# Altium schematic sheet MCU.SchDoc
size A4; Organization: Altium Limited; Address1: L3, 12a Rodborough Rd; Address2: Frenchs Forest; Address3: NSW; Address4: Australia 2086
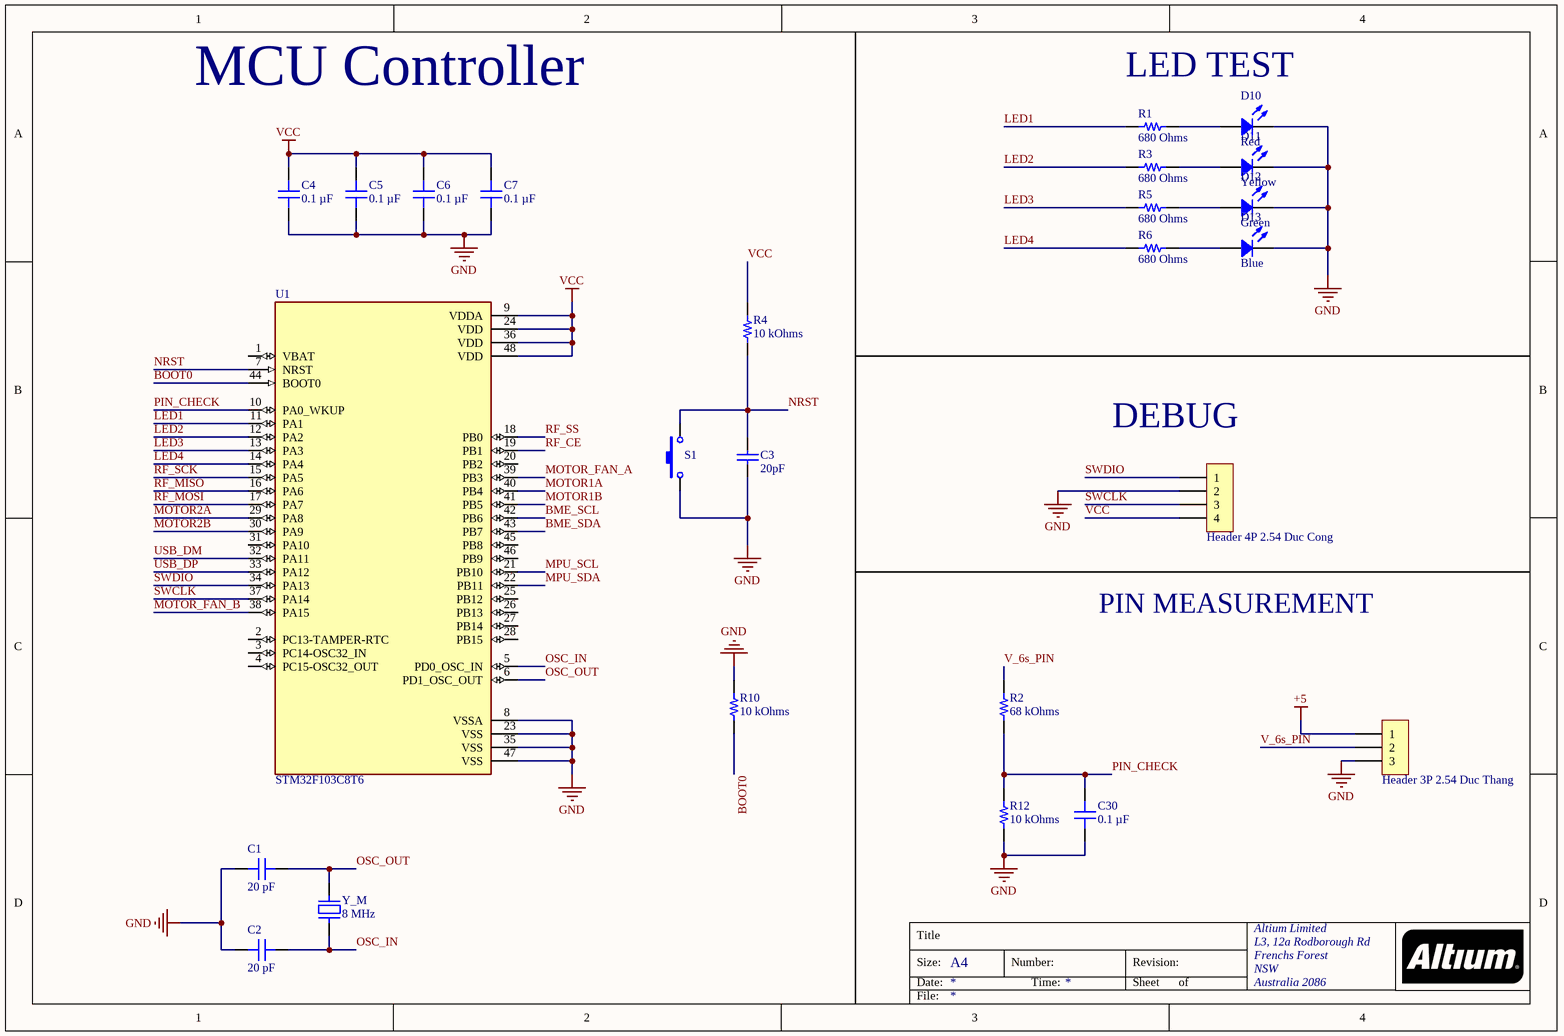
[diagram p0: MCU.SchDoc]

## Parts
C1  20 pF  [CAP 0603_1608]
C2  20 pF  [CAP 0603_1608]
C3  20pF  [tu 0805]
C4  0.1 µF  [CAP 0603_1608]
C5  0.1 µF  [CAP 0603_1608]
C6  0.1 µF  [CAP 0603_1608]
C7  0.1 µF  [CAP 0603_1608]
C30  0.1 µF  [CAP 0603_1608]
D10  Red  [LED 0603_1608 RED]
D11  Yellow  [LED 0603_1608 YELLOW]
D12  Green  [LED 0603_1608 GREEN]
D13  Blue  [LED 0603_1608 BLUE]
H5  Header 4P 2.54 Duc Cong  [Header 4P DC 2.54]
H8  Header 3P 2.54 Duc Thang  [XH2.54M-3]
R1  680 Ohms  [RES 0603_1608]
R2  68 kOhms  [RES 0805_2012]
R3  680 Ohms  [RES 0603_1608]
R4  10 kOhms  [RES 0603_1608]
R5  680 Ohms  [RES 0603_1608]
R6  680 Ohms  [RES 0603_1608]
R10  10 kOhms  [RES 0603_1608]
R12  10 kOhms  [RES 0805_2012]
S1  SW-SMD  [SW-SMD]  (value not drawn)
U1  STM32F103C8T6  [QFP50P900X900X160-48N]
Y_M  8 MHz  [NDK NX5032GA]

## Nets
+5: H8.1
GND: C1.1 C2.1 C3.2 C4.1 C5.1 C6.1 C7.1 C30.1 D10.2 D11.2 D12.2 D13.2 H5.2 H8.3 R10.1 R12.1 S1.1 U1.8(VSSA) U1.23(VSS) U1.35(VSS) U1.47(VSS)
VCC: C4.2 C5.2 C6.2 C7.2 H5.4 R4.2 U1.9(VDDA) U1.24(VDD) U1.36(VDD) U1.48(VDD)
BME_SCL: U1.42(PB6)
BME_SDA: U1.43(PB7)
BOOT0: R10.2 U1.44(BOOT0)
LED1: R1.1 U1.11(PA1)
LED2: R3.1 U1.12(PA2)
LED3: R5.1 U1.13(PA3)
LED4: R6.1 U1.14(PA4)
MOTOR1A: U1.40(PB4)
MOTOR1B: U1.41(PB5)
MOTOR2A: U1.29(PA8)
MOTOR2B: U1.30(PA9)
MOTOR_FAN_A: U1.39(PB3)
MOTOR_FAN_B: U1.38(PA15)
MPU_SCL: U1.21(PB10)
MPU_SDA: U1.22(PB11)
NRST: C3.1 R4.1 S1.2 U1.7(NRST)
OSC_IN: C2.2 U1.5(PD0_OSC_IN) Y_M.2
OSC_OUT: C1.2 U1.6(PD1_OSC_OUT) Y_M.1
PIN_CHECK: C30.2 R2.1 R12.2 U1.10(PA0_WKUP)
RF_CE: U1.19(PB1)
RF_MISO: U1.16(PA6)
RF_MOSI: U1.17(PA7)
RF_SCK: U1.15(PA5)
RF_SS: U1.18(PB0)
SWCLK: H5.3 U1.37(PA14)
SWDIO: H5.1 U1.34(PA13)
USB_DM: U1.32(PA11)
USB_DP: U1.33(PA12)
V_6s_PIN: H8.2 R2.2
NetD10_1: D10.1 R1.2
NetD11_1: D11.1 R3.2
NetD12_1: D12.1 R5.2
NetD13_1: D13.1 R6.2

Not connected (* = marked no-connect by the designer): U1 1(VBAT) 2(PC13-TAMPER-RTC) 3(PC14-OSC32_IN) 4(PC15-OSC32_OUT) 20(PB2) 25(PB12) 26(PB13) 27(PB14) 28(PB15) 31(PA10) 45(PB8) 46(PB9)

## Notes on the sheet
- MCU Controller
- LED TEST
- (near H5) DEBUG
- PIN MEASUREMENT
- Title
- Size:
- Date:
- A4
- Number:
- Time:
- Revision:
- Sheet
- of
- File:

## Library data of the parts
C1 C2 = C0603C200K8HAC7867: CAP CER 20PF 10V X8R 0603; manufacturer: KEMET; Tolerance: ±10%; Part Number: C0603C200K8HAC7867; Value: 20 pF; Applications: General Purpose; Capacitance: 20 pF; componentlink1description: Datasheet; componentlink1url: https://connect.kemet.com:7667/gateway/IntelliData-ComponentDocumentation/1.0/download/datasheet/C0603C200K8HAC7867; componentlink2description: DigiKey Link; componentlink2url: https://www.digikey.com/en/products/detail/kemet/C0603C200K8HAC7867/7946748; Device Package: 0603 (1608 Metric); Features: Low ESL, High Temperature; lastupdated: 2/9/2024 8:09:18 PM; Lifecycle Status: Active; Minimum Order: 1; Mounting Type: Surface Mount, MLCC; Operating Temperature: -55°C ~ 150°C; Package / Case: 0603 (1608 Metric); packaging: TapeAndReel; partid: 52193; Part Status: Active; price: 0.01; series: SMD Comm X8R HT150C; Size / Dimension: 0.063" L x 0.031" W (1.60mm x 0.80mm); Supplier 1: DigiKey; Supplier Part Number 1: 399-C0603C200K8HAC7867CT-ND; Temperature Coefficient: X8R; Thickness (Max): 0.034" (0.87mm); Voltage - Rated: 10V
C3 = Tu 0805 20pF 50V 10%: Dán; Don_Vi: Con; Ten_Linh_Kien: Tụ 0805 20P 10% 50V; So_Chan: 2; Ma_Hang: MH004558; Chung_Loai: Dán; Kieu_Chan: *
C4-C7 = VJ0603Y104MXQCW1BC: CAP CER 0.1UF 10V X7R 0603; manufacturer: Vishay Vitramon; Tolerance: ±20%; Part Number: VJ0603Y104MXQCW1BC; Value: 0.1 µF; Applications: General Purpose; Capacitance: 0.1 µF; componentlink1description: Datasheet; componentlink1url: https://www.vishay.com/docs/28548/vjw1bcbascomseries.pdf; componentlink2description: DigiKey Link; componentlink2url: https://www.digikey.com/en/products/detail/vishay-vitramon/VJ0603Y104MXQCW1BC/8305323; Device Package: 0603 (1608 Metric); lastupdated: 2/9/2024 8:09:54 PM; Lifecycle Status: Active; Minimum Order: 1; Mounting Type: Surface Mount, MLCC; Operating Temperature: -55°C ~ 125°C; Package / Case: 0603 (1608 Metric); packaging: TapeAndReel; partid: 34594; Part Status: Active; price: 0.01; series: VJ W1BC; Size / Dimension: 0.063" L x 0.031" W (1.60mm x 0.80mm); Supplier 1: DigiKey; Supplier Part Number 1: 720-VJ0603Y104MXQCW1BCCT-ND; Temperature Coefficient: X7R; Thickness (Max): 0.034" (0.87mm); Voltage - Rated: 10V
C30 = VJ0603Y104KXQCW1BC: CAP CER 0.1UF 10V X7R 0603; manufacturer: Vishay Vitramon; Tolerance: ±10%; Part Number: VJ0603Y104KXQCW1BC; Value: 0.1 µF; Applications: General Purpose; Capacitance: 0.1 µF; componentlink1description: Datasheet; componentlink1url: https://www.vishay.com/docs/28548/vjw1bcbascomseries.pdf; componentlink2description: DigiKey Link; componentlink2url: https://www.digikey.com/en/products/detail/vishay-vitramon/VJ0603Y104KXQCW1BC/8305317; Device Package: 0603 (1608 Metric); lastupdated: 2/9/2024 8:10:06 PM; Lifecycle Status: Active; Minimum Order: 1; Mounting Type: Surface Mount, MLCC; Operating Temperature: -55°C ~ 125°C; Package / Case: 0603 (1608 Metric); packaging: TapeAndReel; partid: 17766; Part Status: Active; price: 0.02; series: VJ W1BC; Size / Dimension: 0.063" L x 0.031" W (1.60mm x 0.80mm); Supplier 1: DigiKey; Supplier Part Number 1: 720-1689-1-ND; Temperature Coefficient: X7R; Thickness (Max): 0.034" (0.87mm); Voltage - Rated: 10V
D10 = 5975112402F: LED RED DIFFUSED 0603 SMD; Manufacturer: Dialight; Configuration: Standard; Current - Test: 20mA; Lens Color: White; Lens Size: 1.10mm x 0.80mm; Lens Style: Rectangle with Flat Top; Millicandela Rating: 11.7mcd; Viewing Angle: 152°; Voltage - Forward (Vf) (Typ): 1.7V; Wavelength - Dominant: 647nm; Wavelength - Peak: 660nm; Part Number: 5975112402F; Color: Red; ComponentLink1Description: Datasheet; ComponentLink1URL: http://www.dialightsignalsandcomponents.com/Assets/Brochures_And_Catalogs/Indication/597-xxxx-4xx.pdf; ComponentLink2Description: DigiKey Link; ComponentLink2URL: https://www.digikey.com/en/products/detail/dialight/5975112402F/2432586; Device Package: 0603 (1608 Metric); Height (Max): 0.70mm; LastUpdated: 6/3/2024 7:59:47 PM; Lens Transparency: Diffused; Lifecycle Status: Active; Minimum Order: 1; Mounting Type: Surface Mount; Package / Case: 0603 (1608 Metric); Packaging: Strip; PartId: 449; Part Status: Active; Price: 0.24; Series: 597; Size / Dimension: 1.60mm L x 0.80mm W; Supplier 1: DigiKey; Supplier Part Number 1: 350-2890-ND; Supplier Device Package: 2-SMD; Value: Red
D11 = SML-D15YWT86: LED YELLOW DIFFUSED 1608 SMD; Manufacturer: Rohm Semiconductor; Configuration: Standard; Current - Test: 20mA; Lens Color: White; Lens Size: 1.20mm x 0.80mm; Lens Style: Rectangle with Flat Top; Millicandela Rating: 224mcd; Voltage - Forward (Vf) (Typ): 2.1V; Wavelength - Dominant: 590nm; Part Number: SML-D15YWT86; Color: Yellow; ComponentLink1Description: Datasheet; ComponentLink1URL: http://rohmfs.rohm.com/en/products/databook/datasheet/opto/led/chip_mono/sml-d15-e.pdf; ComponentLink2Description: DigiKey Link; ComponentLink2URL: https://www.digikey.com/en/products/detail/rohm-semiconductor/SML-D15YWT86/5822344; Device Package: 0603 (1608 Metric); Height (Max): 0.65mm; LastUpdated: 6/3/2024 8:01:10 PM; Lens Transparency: Diffused; Lifecycle Status: Active; Minimum Order: 1; Mounting Type: Surface Mount; Package / Case: 0603 (1608 Metric); Packaging: TapeAndReel; PartId: 114; Part Status: Active; Price: 0.06; Series: SML-D15; Size / Dimension: 1.60mm L x 0.80mm W; Supplier 1: DigiKey; Supplier Part Number 1: SML-D15YWT86DKR-ND; Supplier Device Package: 1608 (0603); Value: Yellow
D12 = SML-D13M8WT86: LED GREEN DIFFUSED 1608 SMD; Manufacturer: Rohm Semiconductor; Configuration: Standard; Current - Test: 20mA; Lens Color: White; Lens Size: 1.20mm x 0.80mm; Lens Style: Rectangle with Flat Top; Millicandela Rating: 40mcd; Voltage - Forward (Vf) (Typ): 2.2V; Wavelength - Dominant: 572nm; Part Number: SML-D13M8WT86; Color: Green; ComponentLink1Description: Datasheet; ComponentLink1URL: https://www.rohm.com/datasheet/SML-D12V8W; ComponentLink2Description: DigiKey Link; ComponentLink2URL: https://www.digikey.com/en/products/detail/rohm-semiconductor/SML-D13M8WT86/4004597; Device Package: 0603 (1608 Metric); Height (Max): 0.65mm; LastUpdated: 6/3/2024 7:58:53 PM; Lens Transparency: Diffused; Lifecycle Status: Active; Minimum Order: 1; Mounting Type: Surface Mount; Package / Case: 0603 (1608 Metric); Packaging: TapeAndReel; PartId: 617; Part Status: Active; Price: 0.04; Series: EXCELED™; Size / Dimension: 1.60mm L x 0.80mm W; Supplier 1: DigiKey; Supplier Part Number 1: 846-1198-1-ND; Supplier Device Package: 1608 (0603); Value: Green
D13 = LB Q39G-L2OO-35-1: LED BLUE DIFFUSED 0603 SMD; Manufacturer: OSRAM Opto Semiconductors Inc.; Configuration: Standard; Current - Test: 5mA; Lens Color: White; Lens Size: 1.10mm x 0.80mm; Lens Style: Rectangle with Flat Top; Millicandela Rating: 29.5mcd; Viewing Angle: 155°, 135°; Voltage - Forward (Vf) (Typ): 2.85V; Wavelength - Dominant: 470nm; Wavelength - Peak: 472nm; Part Number: LB Q39G-L2OO-35-1; Color: Blue; ComponentLink1Description: Datasheet; ComponentLink1URL: //media.digikey.com/pdf/Data%20Sheets/Osram%20PDFs/LB_Q39G_v1.4_9-1-15.pdf; ComponentLink2Description: DigiKey Link; ComponentLink2URL: https://www.digikey.com/en/products/detail/osram-opto-semiconductors-inc/LB-Q39G-L2OO-35-1/2176322; Device Package: 0603 (1608 Metric); Height (Max): 0.40mm; LastUpdated: 6/3/2024 7:57:52 PM; Lens Transparency: Diffused; Lifecycle Status: Active; Minimum Order: 1; Mounting Type: Surface Mount; Package / Case: 0603 (1608 Metric); Packaging: TapeAndReel; PartId: 832; Part Status: Active; Price: 0.06; Series: CHIPLED 0603; Size / Dimension: 1.60mm L x 0.80mm W; Supplier 1: DigiKey; Supplier Part Number 1: 475-2816-1-ND; Supplier Device Package: 0603; Value: Blue
H5 = Header 4P 2.54 Duc Cong: Cắm; Ten_Linh_Kien: Header 4P XH2.54-4P Đực Cong; Don_Vi: Con; Ma_Hang: MH001310; Chung_Loai: Cắm
H8 = Header 3P 2.54 Duc Thang: Cắm; Ten_Linh_Kien: Header 3P XH2.54-3P Đực Thẳng; Don_Vi: Con; Ma_Hang: MH001292; Chung_Loai: Cắm
R1 R3 R5 R6 = CRGCQ0603F680R: RES 680 OHM 1% 1/10W 0603; Manufacturer: TE Connectivity Passive Product; Power (Watts): 0.1W, 1/10W; Temperature Coefficient: ±100ppm/°C; Part Number: CRGCQ0603F680R; Value: 680 Ohms; ComponentLink1Description: Datasheet; ComponentLink1URL: https://www.te.com/commerce/DocumentDelivery/DDEController?Action=srchrtrv&DocNm=1773204-3&DocType=DS&DocLang=English; ComponentLink2Description: DigiKey Link; ComponentLink2URL: https://www.digikey.com/en/products/detail/te-connectivity-passive-product/CRGCQ0603F680R/8576288; Composition: Thick Film; Device Package: 0603 (1608 Metric); Features: Automotive AEC-Q200, Moisture Resistant; Height - Seated (Max): 0.022" (0.55mm); LastUpdated: 2/9/2024 8:42:15 PM; Lifecycle Status: Active; Minimum Order: 1; Number of Terminations: 2; Operating Temperature: -55°C ~ 155°C; Package / Case: 0603 (1608 Metric); Packaging: TapeAndReel; PartId: 23982; Part Status: Active; Price: 0.01; Ratings: AEC-Q200; Resistance: 680 Ohms; Series: CRGCQ; Size / Dimension: 0.063" L x 0.031" W (1.60mm x 0.80mm); Supplier 1: DigiKey; Supplier Part Number 1: A129686CT-ND; Supplier Device Package: 0603; Tolerance: ±1%
R2 = RR1220P-683-D: RES SMD 68K OHM 0.5% 1/10W 0805; Manufacturer: Susumu; Power (Watts): 0.1W, 1/10W; Temperature Coefficient: ±25ppm/°C; Part Number: RR1220P-683-D; Value: 68 kOhms; ComponentLink1Description: Datasheet; ComponentLink1URL: http://www.susumu.co.jp/common/pdf/n_catalog_partition05_en.pdf; ComponentLink2Description: DigiKey Link; ComponentLink2URL: https://www.digikey.com/en/products/detail/susumu/RR1220P-683-D/432335; Composition: Thin Film; Device Package: 0805 (2012 Metric); Height - Seated (Max): 0.020" (0.50mm); LastUpdated: 2/8/2024 9:01:51 PM; Lifecycle Status: Active; Minimum Order: 1; Number of Terminations: 2; Operating Temperature: -55°C ~ 125°C; Package / Case: 0805 (2012 Metric); Packaging: TapeAndReel; PartId: 39193; Part Status: Active; Price: 0.01; Resistance: 68 kOhms; Series: RR; Size / Dimension: 0.079" L x 0.049" W (2.00mm x 1.25mm); Supplier 1: DigiKey; Supplier Part Number 1: RR12P68.0KDCT-ND; Tolerance: ±0.5%
R4 R10 = CRCW060310K0FHEAP: RES SMD 10K OHM 1% 1/10W 0603; Manufacturer: Vishay Dale; Power (Watts): 0.1W, 1/10W; Temperature Coefficient: ±50ppm/°C; Part Number: CRCW060310K0FHEAP; Value: 10 kOhms; ComponentLink1Description: Datasheet; ComponentLink1URL: http://www.vishay.com/docs/20036/dcrcwpe3.pdf; ComponentLink2Description: DigiKey Link; ComponentLink2URL: https://www.digikey.com/en/products/detail/vishay-dale/CRCW060310K0FHEAP/5070668; Composition: Thick Film; Device Package: 0603 (1608 Metric); Features: Automotive AEC-Q200; Height - Seated (Max): 0.020" (0.50mm); LastUpdated: 2/9/2024 8:41:44 PM; Lifecycle Status: Active; Minimum Order: 1; Number of Terminations: 2; Operating Temperature: -55°C ~ 155°C; Package / Case: 0603 (1608 Metric); Packaging: TapeAndReel; PartId: 56447; Part Status: Active; Price: 0.03; Ratings: AEC-Q200; Resistance: 10 kOhms; Series: CRCW-P; Size / Dimension: 0.063" L x 0.033" W (1.60mm x 0.85mm); Supplier 1: DigiKey; Supplier Part Number 1: 541-CRCW060310K0FHEAPCT-ND; Supplier Device Package: 0603; Tolerance: ±1%
R12 = RNCS0805BKE10K0: RES 10K OHM 0.1% 1/10W 0805; Manufacturer: Stackpole Electronics Inc; Power (Watts): 0.1W, 1/10W; Temperature Coefficient: ±25ppm/°C; Part Number: RNCS0805BKE10K0; Value: 10 kOhms; ComponentLink1Description: Datasheet; ComponentLink1URL: https://www.seielect.com/catalog/sei-rncs_rnch.pdf; ComponentLink2Description: DigiKey Link; ComponentLink2URL: https://www.digikey.com/en/products/detail/stackpole-electronics-inc/RNCS0805BKE10K0/1800067; Composition: Thin Film; Device Package: 0805 (2012 Metric); Features: Anti-Corrosive, Automotive AEC-Q200, Moisture Resistant; Height - Seated (Max): 0.026" (0.65mm); LastUpdated: 2/8/2024 9:02:39 PM; Lifecycle Status: Active; Minimum Order: 1; Number of Terminations: 2; Operating Temperature: -55°C ~ 155°C; Package / Case: 0805 (2012 Metric); Packaging: TapeAndReel; PartId: 27713; Part Status: Active; Price: 0.07; Ratings: AEC-Q200; Resistance: 10 kOhms; Series: RNCS; Size / Dimension: 0.079" L x 0.049" W (2.00mm x 1.25mm); Supplier 1: DigiKey; Supplier Part Number 1: RNCS0805BKE10K0CT-ND; Supplier Device Package: 0805; Tolerance: ±0.1%
S1 = SW-SMD: Switch; Published: 24-Mar-1999; LatestRevisionDate: 17-Jul-2002; LatestRevisionNote: Re-released for DXP Platform.; PackageReference: SPST-2; Publisher: Altium Limited
U1 = STM32F103C8T6: ARMÂ® CortexÂ®-M3 STM32F1 Microcontroller IC 32-Bit 72MHz 64KB (64K x 8) FLASH 48-LQFP (7x7); MF: STMicroelectronics; Package: LQFP-48 STMicroelectronics; Price: None; Check_prices: https://www.snapeda.com/parts/STM32F103C8T6/STMicroelectronics/view-part/?ref=eda; Value: *; SnapEDA_Link: https://www.snapeda.com/parts/STM32F103C8T6/STMicroelectronics/view-part/?ref=snap; MP: STM32F103C8T6; Availability: In Stock; Purchase-URL: https://pricing.snapeda.com/search/part/STM32F103C8T6/?ref=eda
Y_M = NX5032GA-8MHZ-EXS00A-CG07039: CRYSTAL 8.0000MHZ 18PF SMD; Manufacturer: NDK America, Inc.; ESR (Equivalent Series Resistance): 300 Ohms; Frequency Stability: ±30ppm; Frequency Tolerance: ±20ppm; Operating Mode: Fundamental; Part Number: NX5032GA-8MHZ-EXS00A-CG07039; ComponentLink1Description: Datasheet; ComponentLink1URL: //media.digikey.com/pdf/Data%20Sheets/NDK%20PDFs/NX5032GA-8MHz-EXS00A-CG07039.pdf; ComponentLink2Description: DigiKey Link; ComponentLink2URL: https://www.digikey.com/en/products/detail/ndk-america-inc/NX5032GA-8MHZ-EXS00A-CG07039/8275423; Frequency: 8 MHz; Height - Seated (Max): 0.059" (1.50mm); LastUpdated: 6/3/2024 8:02:22 PM; Lifecycle Status: Active; Load Capacitance: 18pF; Minimum Order: 1; Mounting Type: Surface Mount; Operating Temperature: -40°C ~ 85°C; Package / Case: 2-SMD, No Lead; Packaging: TapeAndReel; PartId: 609; Part Status: Active; Price: 0.32; Series: NX5032GA; Size / Dimension: 0.197" L x 0.126" W (5.00mm x 3.20mm); Supplier 1: DigiKey; Supplier Part Number 1: 644-1318-1-ND; Type: MHz Crystal; Value: 8 MHz